# EAGLE design GS2011M (EAGLE 6.3)
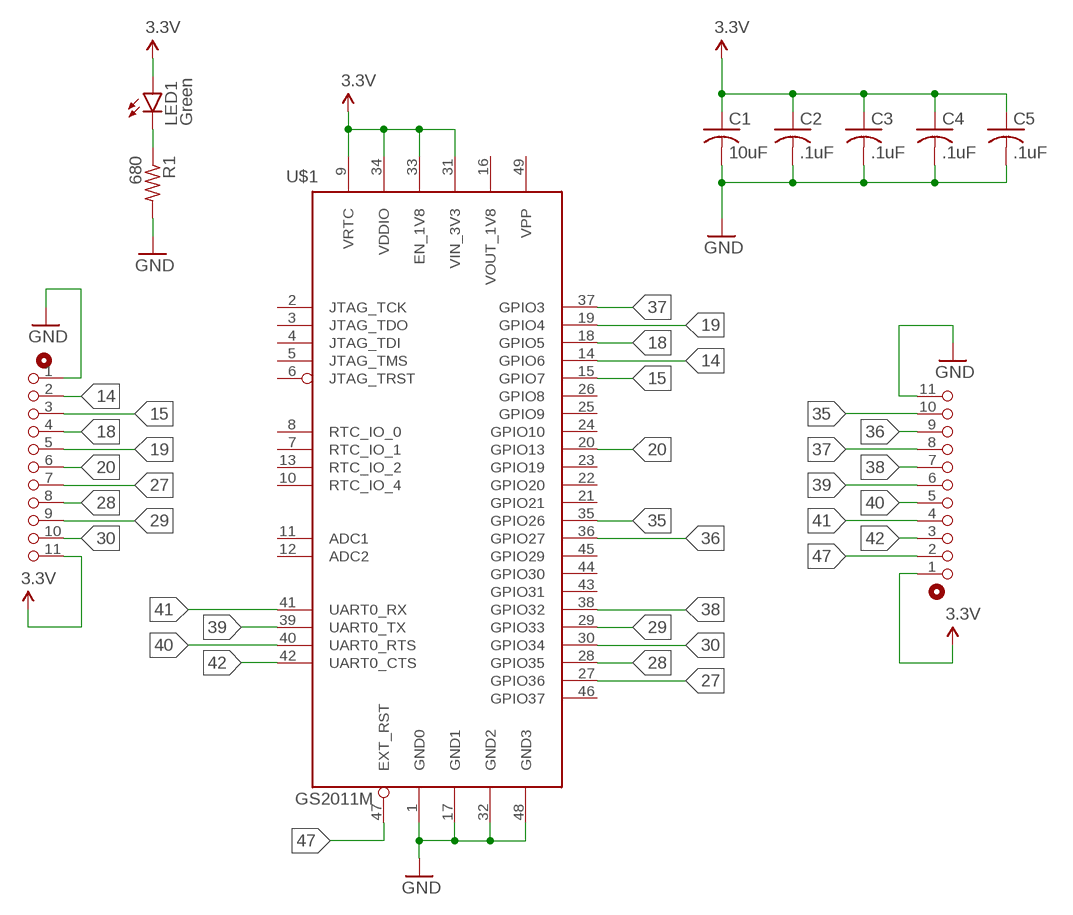
[diagram p0: schematic, sheet 1]

## Parts
C1  10uF  CAP0603  [0603_CAP]
C2  .1uF  CAP0603  [0603_CAP]
C3  .1uF  CAP0603  [0603_CAP]
C4  .1uF  CAP0603  [0603_CAP]
C5  .1uF  CAP0603  [0603_CAP]
LED1  Green  LED0603  [0603_LED]
P1  PIN-11X1  [PIN-11X1]
P2  PIN-11X1  [PIN-11X1]
R1  680  RESISTOR0603  [0603_RESISTOR]
U$1  GS2011M  [GS2011M]

## Nets
3.3V: C1.1 C2.1 C3.1 C4.1 C5.1 LED1.A P1.11 P2.1 U$1.9(VRTC) U$1.31(VIN_3V3) U$1.33(EN_1V8) U$1.34(VDDIO)
14: P1.2 U$1.14(GPIO6)
15: P1.3 U$1.15(GPIO7)
18: P1.4 U$1.18(GPIO5)
19: P1.5 U$1.19(GPIO4)
20: P1.6 U$1.20(GPIO13)
27: P1.7 U$1.27(GPIO36)
28: P1.8 U$1.28(GPIO35)
29: P1.9 U$1.29(GPIO33)
30: P1.10 U$1.30(GPIO34)
35: P2.10 U$1.35(GPIO26)
36: P2.9 U$1.36(GPIO27)
37: P2.8 U$1.37(GPIO3)
38: P2.7 U$1.38(GPIO32)
39: P2.6 U$1.39(UART0_TX)
40: P2.5 U$1.40(UART0_RTS)
41: P2.4 U$1.41(UART0_RX)
42: P2.3 U$1.42(UART0_CTS)
47: P2.2 U$1.47(EXT_RST)
GND: C1.2 C2.2 C3.2 C4.2 C5.2 P1.1 P2.11 R1.2 U$1.1(GND0) U$1.17(GND1) U$1.32(GND2) U$1.48(GND3)
N$3: LED1.C R1.1
Unconnected: U$1.2(JTAG_TCK) U$1.3(JTAG_TDO) U$1.4(JTAG_TDI) U$1.5(JTAG_TMS) U$1.6(JTAG_TRST) U$1.7(RTC_IO_1) U$1.8(RTC_IO_0) U$1.10(RTC_IO_4) U$1.11(ADC1) U$1.12(ADC2) U$1.13(RTC_IO_2) U$1.21(GPIO21) U$1.22(GPIO20) U$1.23(GPIO19) U$1.24(GPIO10) U$1.25(GPIO9) U$1.26(GPIO8) U$1.43(GPIO31) U$1.44(GPIO30) U$1.45(GPIO29) U$1.46(GPIO37) U$1.49(VPP)

## Power pins joined to a net without a drawn wire
VOUT_1V8: U$1.16(VOUT_1V8)

## Library data of the parts
C1-C5 = jkf:CAP
LED1 = jkf:LED; DIGIKEY#: 516-2493-1-ND; MANF: Avago Technologies; MANF#: HSMG-C191
P1 P2 = jkf:PIN-11X1
R1 = jkf:RESISTOR
U$1 = jkf:GS2011M: Gainspan 2011M WiFi Module

## Board
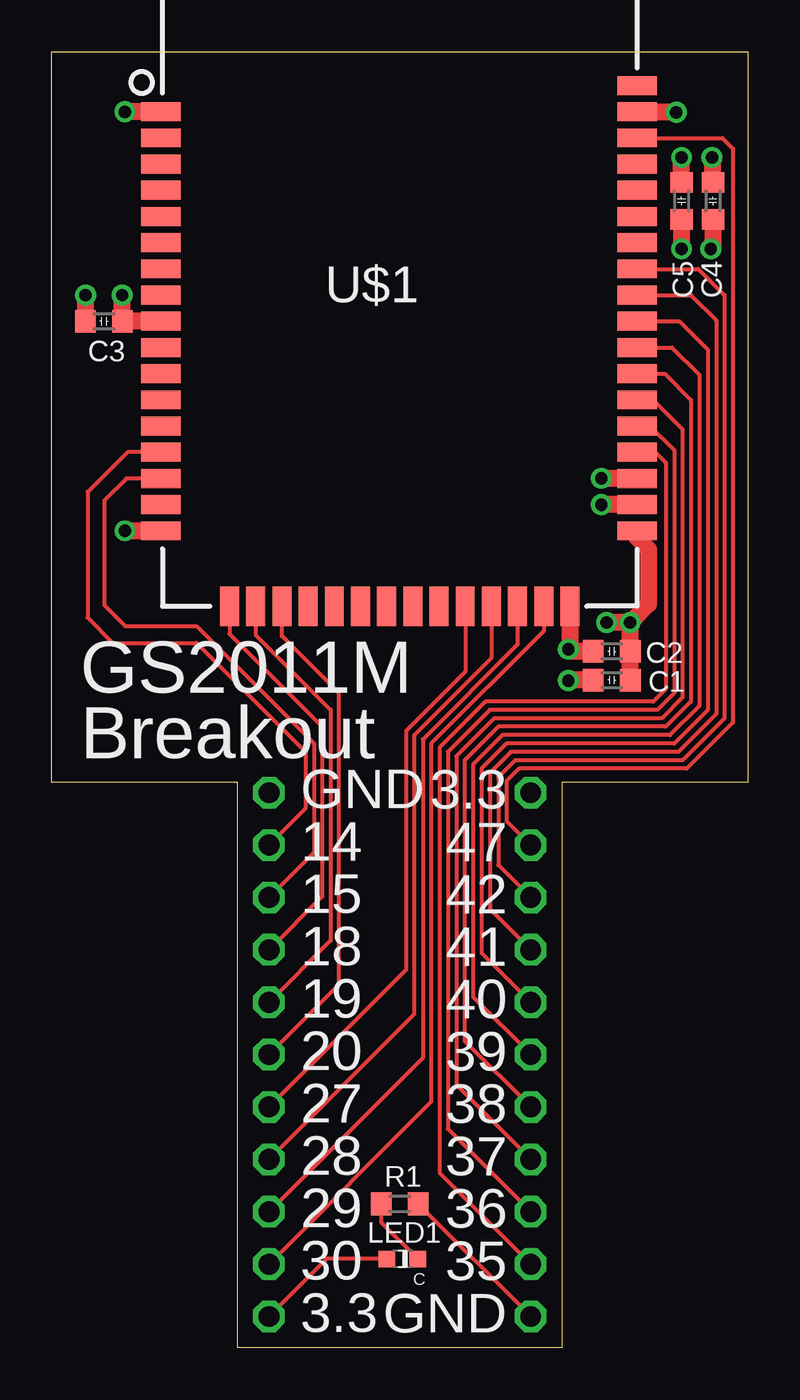
[diagram p1: board, top side]
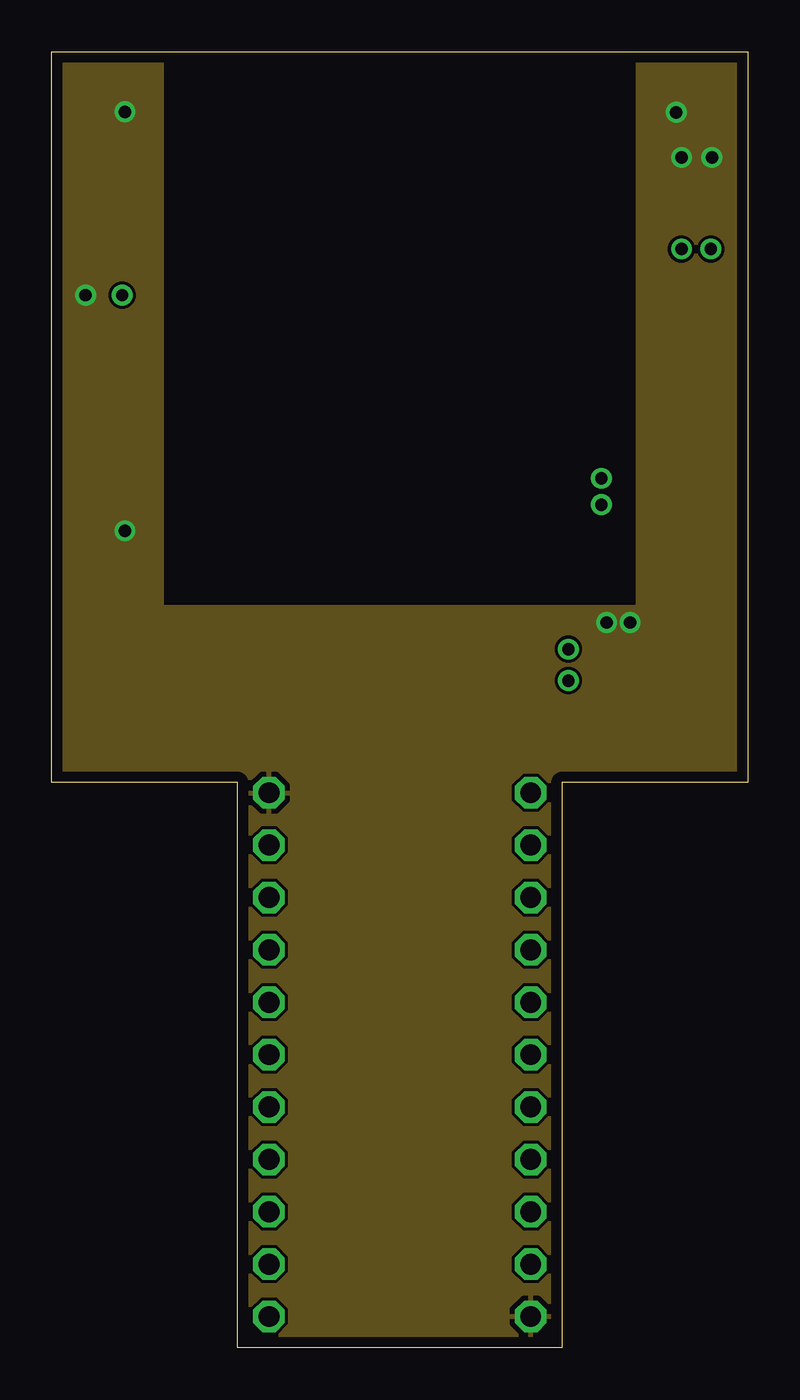
[diagram p2: board, inner layer GND]
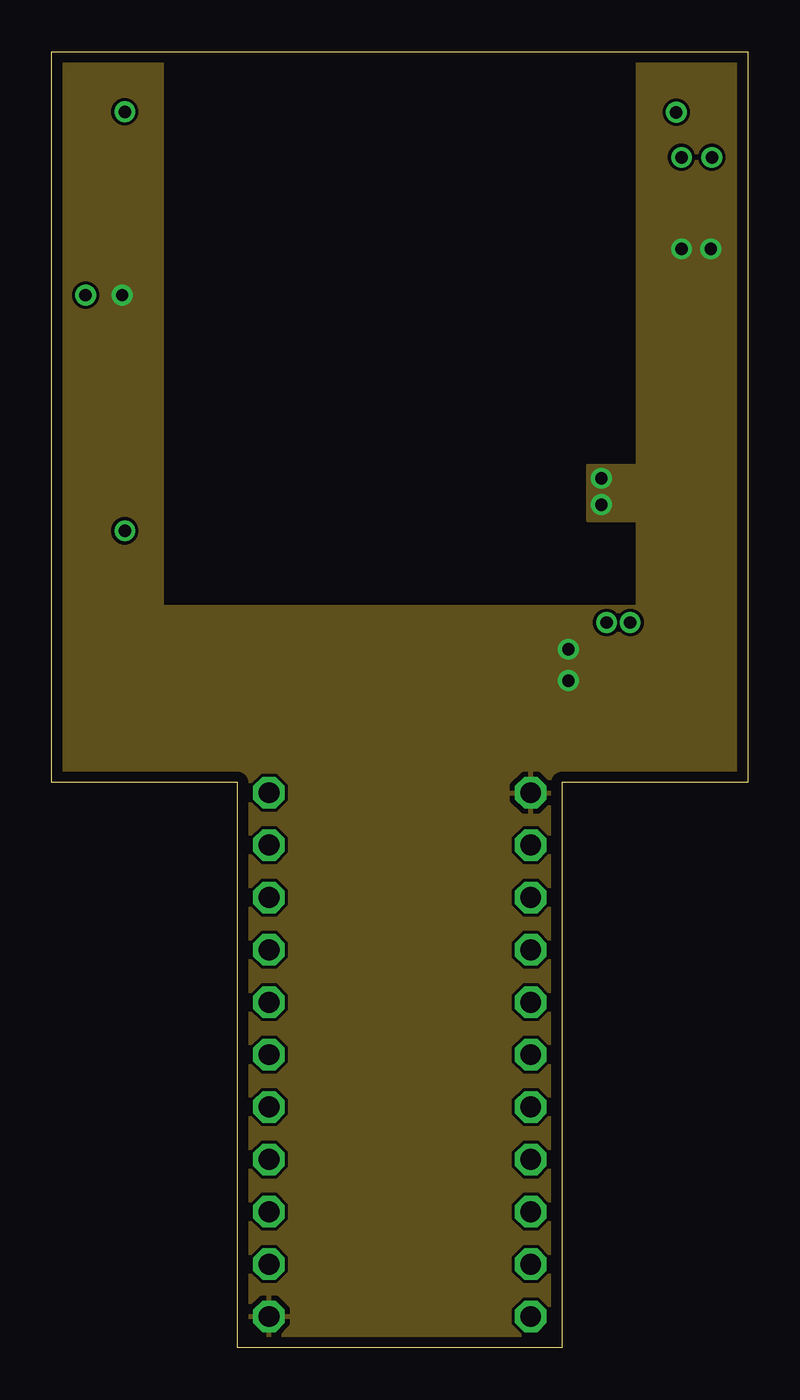
[diagram p3: board, inner layer 3.3V]
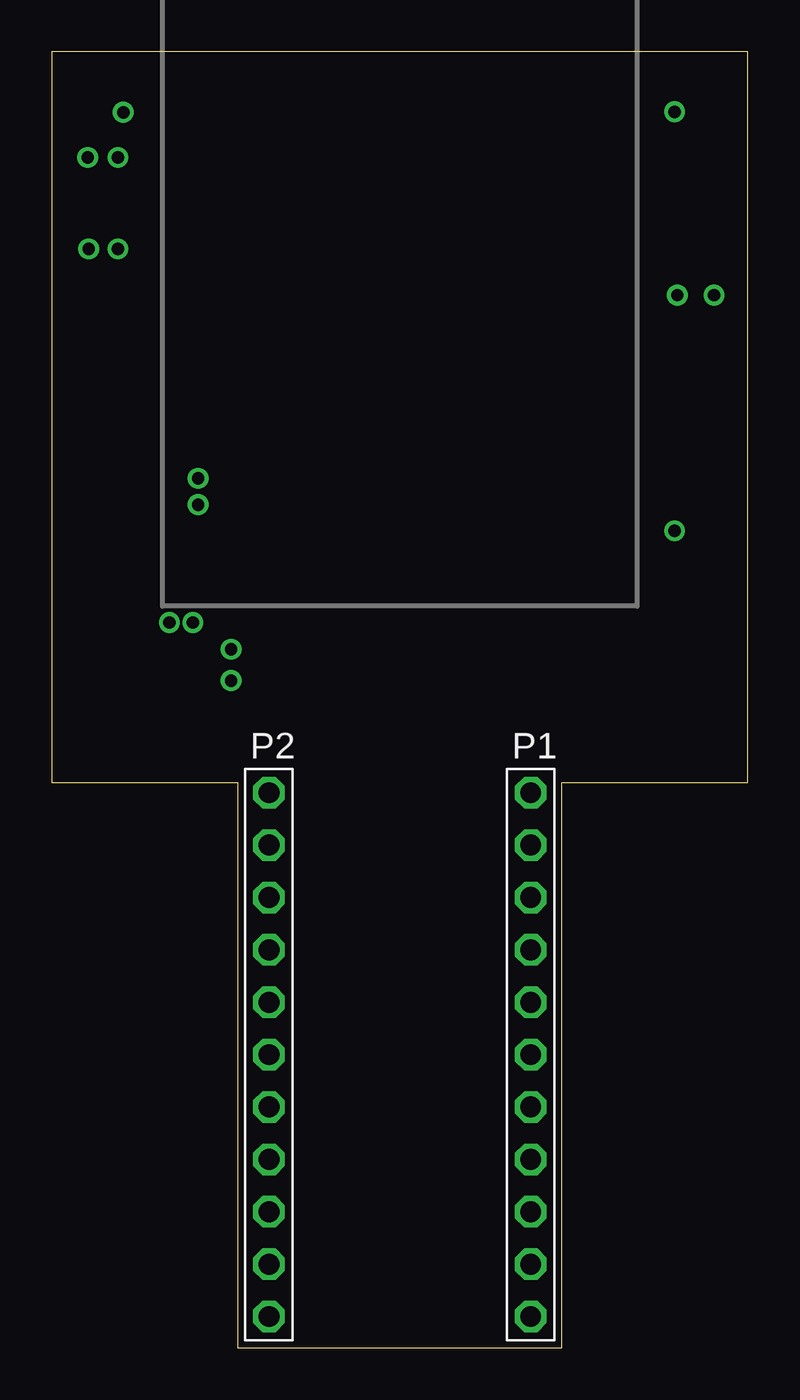
[diagram p4: board, bottom side, seen from below]

Size 33.78 x 62.87 mm. Coordinates in mm from the lower left corner, seen from the top.
Outline: 0,62.87 33.78,62.87 33.78,27.43 24.77,27.43 24.77,0 9.02,0 9.02,27.43 0,27.43 0,62.87
Copper layers (1+2*15+16): Top 0.0178mm / dielectric 12mil / GND 0.0356mm / dielectric 28mil / 3.3V 0.0356mm / dielectric 12mil / Bottom 0.0178mm
Design rules "SSC-EAGLE-4Lyr_v1.0.0.3": minimum track width 6mil, minimum drill 8mil, track to track 6mil, track to pad 6mil, pad to pad 6mil, via to via 6mil, smd to smd 6mil, copper to edge 20mil, drill to drill 16mil, minimum pad ring 8mil, minimum via ring 8mil, stop-mask expansion 3mil, vias tented up to drill 0mil, thermal gap 10mil

### Footprints (pad centres in the part's own frame; a part is rotated, then mirrored left to right if it is on the bottom)
0603_CAP = smd 1 x 1.1: 1 -0.9,0; 2 0.9,0
0603_LED = smd 0.8 x 0.8: A 0.75,0; C -0.75,0
PIN-11X1 = drill 1.016 octagon: 1 0,-12.7; 2 0,-10.16; 3 0,-7.62; 4 0,-5.08; 5 0,-2.54; 6 0,0; 7 0,2.54; 8 0,5.08; 9 0,7.62; 10 0,10.16; 11 0,12.7
0603_RESISTOR = smd 1 x 1.1: 1 -0.9,0; 2 0.9,0
GS2011M = smd 1.905 x 0.914: 1 -11.76,7.468; 2 -11.76,6.198; 3 -11.76,4.928; 4 -11.76,3.658; 5 -11.76,2.388; 6 -11.76,1.118; 7 -11.76,-0.152; 8 -11.76,-1.422; 9 -11.76,-2.692; 10 -11.76,-3.962; 11 -11.76,-5.232; 12 -11.76,-6.502; 13 -11.76,-7.772; 14 -11.76,-9.042; 15 -11.76,-10.312; 16 -11.76,-11.582; 17 -11.76,-12.852; 32 11.328,-12.852; 33 11.328,-11.582; 34 11.328,-10.312; 35 11.328,-9.042; 36 11.328,-7.772; 37 11.328,-6.502; 38 11.328,-5.232; 39 11.328,-3.962; 40 11.328,-2.692; 41 11.328,-1.422; 42 11.328,-0.152; 43 11.328,1.118; 44 11.328,2.388; 45 11.328,3.658; 46 11.328,4.928; 47 11.328,6.198; 48 11.328,7.468; 49 11.328,8.738 | smd 0.914 x 1.905: 18 -8.433,-16.51; 19 -7.163,-16.51; 20 -5.893,-16.51; 21 -4.623,-16.51; 22 -3.353,-16.51; 23 -2.083,-16.51; 24 -0.813,-16.51; 25 0.457,-16.51; 26 1.727,-16.51; 27 2.997,-16.51; 28 4.267,-16.51; 29 5.537,-16.51; 30 6.807,-16.51; 31 8.077,-16.51

### Placement (x,y rotation side)
C1  27.18,32.38 0 top
C2  27.18,33.78 0 top
C3  2.54,49.78 180 top
C4  32.08,55.63 90 top
C5  30.56,55.63 90 top
LED1  17.02,4.32 180 top
P1  10.54,14.22 180 top
P2  23.24,14.22 180 top
R1  16.89,6.99 0 top
U$1  17.07,52.48 0 top

### Tracks (layer width: path | path; a pad name or v marks a point on that pad's centre or on a via)
3.3V  (via drill 0.6)
  Top 0.203: LED1.A 13.34,4.32 P1.11
  Top 0.813: U$1.33 v26.67,40.89 | U$1.34 v26.67,42.16 | U$1.9 C3.1 3.43,49.78 v3.43,51.05 | C4.1 32.08,53.39 v31.98,53.29 | C5.1 v30.56,53.29 | C1.1 25.09,32.38 v25.07,32.36 | U$1.31 25.15,33.96 v25.07,33.88 25.17,33.78 C2.1
  pour 3.3V: 0,62.87 5.33,62.87 5.33,35.94 28.45,35.94 28.45,40.13 26.04,40.13 26.04,42.8 28.45,42.8 28.45,62.87 33.78,62.87 33.78,27.43 24.77,27.43 24.77,0 9.02,0 9.02,27.43 0,27.43
14
  Top 0.203: U$1.14 3.68,43.43 1.75,41.5 1.75,35.41 2.97,34.19 7.04,34.19 12.32,28.91 12.32,26.16 P1.2
15
  Top 0.203: U$1.15 3.63,42.16 2.56,41.1 2.56,36.02 3.58,35 7.04,35 12.72,29.31 12.72,24.03 P1.3
18
  Top 0.203: U$1.18 8.64,34.62 13.13,30.12 13.13,21.89 P1.4
19
  Top 0.203: U$1.19 9.91,34.57 13.54,30.94 13.54,19.76 P1.5
20
  Top 0.203: P1.6 13.95,17.63 13.95,31.75 11.18,34.52 U$1.20
27
  Top 0.203: U$1.27 20.07,32.79 17.2,29.92 17.2,18.34 P1.7
28
  Top 0.203: U$1.28 21.34,33.45 17.6,29.72 17.6,16.2 P1.8
29
  Top 0.203: U$1.29 22.61,34.11 18.01,29.52 18.01,14.07 P1.9
30
  Top 0.203: U$1.30 23.88,34.77 18.41,29.31 18.41,11.94 P1.10
35
  Top 0.203: U$1.35 29.29,43.43 29.79,42.93 29.79,31.95 29.18,31.34 21.06,31.34 18.82,29.11 18.82,8.48 P2.10
36
  Top 0.203: U$1.36 29.03,44.7 30.2,43.54 30.2,31.75 29.39,30.94 21.26,30.94 19.23,28.91 19.23,10.62 P2.9
37
  Top 0.203: U$1.37 29.18,45.97 30.61,44.55 30.61,31.55 29.59,30.53 21.46,30.53 19.63,28.7 19.63,12.75 P2.8
38
  Top 0.203: U$1.38 29.74,47.24 31.01,45.97 31.01,31.34 29.79,30.12 21.67,30.12 20.04,28.5 20.04,14.88 P2.7
39
  Top 0.203: U$1.39 30.1,48.51 31.42,47.19 31.42,31.14 30,29.72 21.87,29.72 20.45,28.3 20.45,17.02 P2.6
40
  Top 0.203: U$1.40 30.45,49.78 31.83,48.41 31.83,30.94 30.2,29.31 22.07,29.31 20.85,28.09 20.85,19.15 P2.5
41
  Top 0.203: U$1.41 31.01,51.05 32.23,49.84 32.23,30.73 30.4,28.91 22.28,28.91 21.26,27.89 21.26,21.29 P2.4
42
  Top 0.203: U$1.42 31.37,52.32 32.64,51.05 32.64,30.53 30.61,28.5 22.48,28.5 21.67,27.69 21.67,23.42 P2.3
47
  Top 0.203: U$1.47 32.54,58.67 33.05,58.17 33.05,30.33 30.81,28.09 22.68,28.09 22.07,27.48 22.07,25.55 P2.2
GND  (via drill 0.6)
  Top 0.203: R1.2 17.79,6.97 P2.11
  Top 0.813: C3.2 1.65,49.78 v1.65,51.05 | U$1.1 v3.56,59.94 | U$1.32 28.4,39.29 28.96,38.73 28.96,36.07 v28.07,35.18 | v28.07,35.18 v26.92,35.18 | C5.2 v30.56,57.73 | C4.2 32.08,57.68 v32.03,57.73 | U$1.48 30.28,59.94 v30.3,59.92 | U$1.17 v3.56,39.62 | C1.2 C2.2 28.08,35.17 v28.07,35.18
  pour GND: 0,62.87 5.33,62.87 5.33,35.94 28.45,35.94 28.45,62.87 33.78,62.87 33.78,27.43 24.77,27.43 24.77,0 9.02,0 9.02,27.43 0,27.43
N$3
  Top 0.203: R1.1 15.99,6.09 LED1.C

### Text on the board
tSilk: GS2011M | Breakout | 3.3 | GND | 47 | 14 | 42 | 15 | 41 | 18 | 40 | 19 | 39 | 20 | 38 | 27 | 37 | 28 | 36 | 29 | 35 | 30 | C | GND | 3.3